# EAGLE design henryfc (EAGLE 9.6.2)
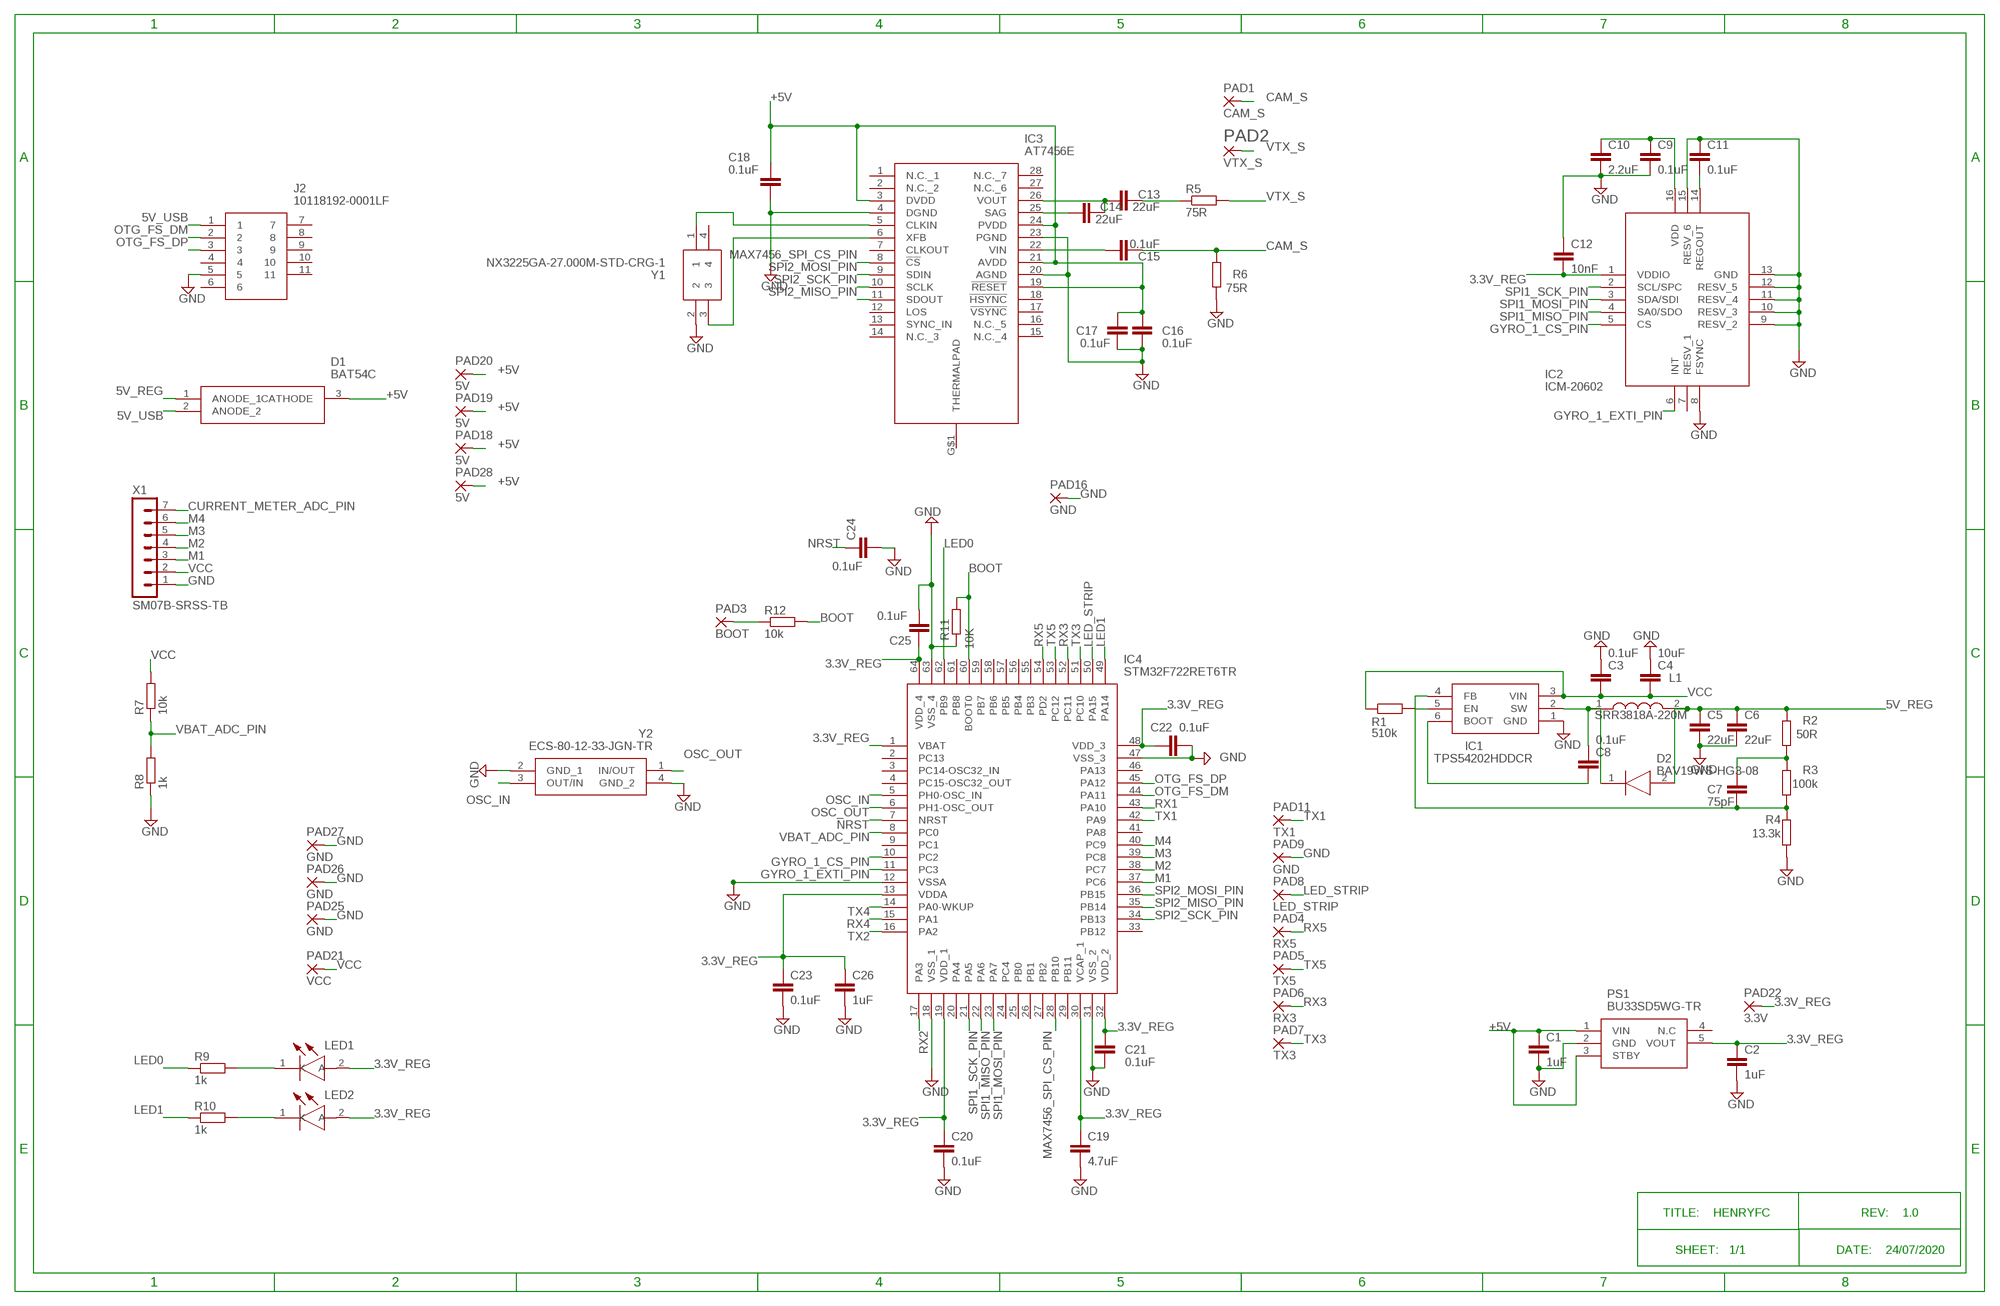
[diagram p0: schematic, sheet 1]

## Parts
C1  1uF  C-EUC0603  [C0603]
C2  1uF  C-EUC0603  [C0603]
C3  0.1uF  C-EUC0603  [C0603]
C4  10uF  C-EUC0603  [C0603]
C5  22uF  C-EUC0603  [C0603]
C6  22uF  C-EUC0603  [C0603]
C7  75pF  C-EUC0603  [C0603]
C8  0.1uF  C-EUC0603  [C0603]
C9  0.1uF  C-EUC0603  [C0603]
C10  2.2uF  C-EUC0603  [C0603]
C11  0.1uF  C-EUC0603  [C0603]
C12  10nF  C-EUC0603  [C0603]
C13  22uF  C-EUC0603  [C0603]
C14  22uF  C-EUC0603  [C0603]
C15  0.1uF  C-EUC0603  [C0603]
C16  0.1uF  C-EUC0603  [C0603]
C17  0.1uF  C-EUC0603  [C0603]
C18  0.1uF  C-EUC0603  [C0603]
C19  4.7uF  C-EUC0603  [C0603]
C20  0.1uF  C-EUC0603  [C0603]
C21  0.1uF  C-EUC0603  [C0603]
C22  0.1uF  C-EUC0603  [C0603]
C23  0.1uF  C-EUC0603  [C0603]
C24  0.1uF  C-EUC0603  [C0603]
C25  0.1uF  C-EUC0603  [C0603]
C26  1uF  C-EUC0603  [C0603]
D1  BAT54C  [SOT95P240X120-3N]
D2  BAV19WS-HG3-08  [SOD2713X115N]
IC1  TPS54202HDDCR  [SOT95P280X110-6N]
IC2  ICM-20602  [PULL-BACK-QFN-16]
IC3  AT7456E  [SOP65P640X120-29N]
IC4  STM32F722RET6TR  [QFP50P1200X1200X160-64N]
J2  10118192-0001LF  [101181920001LF]
L1  SRR3818A-220M  [SRR3818A3R3Y]
LED1  KB_DELPS2.12-QHRI-24-Z555-10-S  [KBDELPS212QHRI24Z55510S]
LED2  KR_DELPS1.22-UHVI-26-H3Q4  [KRDELPS122UHVI26H3Q4]
PAD1  CAM_S  SMD2  [SMD1,27-2,54]
PAD2  VTX_S  SMD2  [SMD1,27-2,54]
PAD3  BOOT  SMD2  [SMD1,27-2,54]
PAD4  RX5  SMD2  [SMD1,27-2,54]
PAD5  TX5  SMD2  [SMD1,27-2,54]
PAD6  RX3  SMD2  [SMD1,27-2,54]
PAD7  TX3  SMD2  [SMD1,27-2,54]
PAD8  LED_STRIP  SMD2  [SMD1,27-2,54]
PAD9  GND  SMD2  [SMD1,27-2,54]
PAD11  TX1  SMD2  [SMD1,27-2,54]
PAD16  GND  SMD2  [SMD1,27-2,54]
PAD18  5V  SMD2  [SMD1,27-2,54]
PAD19  5V  SMD2  [SMD1,27-2,54]
PAD20  5V  SMD2  [SMD1,27-2,54]
PAD21  VCC  SMD2  [SMD1,27-2,54]
PAD22  3.3V  SMD2  [SMD1,27-2,54]
PAD25  GND  SMD2  [SMD1,27-2,54]
PAD26  GND  SMD2  [SMD1,27-2,54]
PAD27  GND  SMD2  [SMD1,27-2,54]
PAD28  5V  SMD2  [SMD1,27-2,54]
PS1  BU33SD5WG-TR  [SOT95P280X125-5N]
R1  510k  R-EU_R0603  [R0603]
R2  50R  R-EU_R0603  [R0603]
R3  100k  R-EU_R0603  [R0603]
R4  13.3k  R-EU_R0603  [R0603]
R5  75R  R-EU_R0603  [R0603]
R6  75R  R-EU_R0603  [R0603]
R7  10k  R-EU_R0603  [R0603]
R8  1k  R-EU_R0603  [R0603]
R9  1k  R-EU_R0603  [R0603]
R10  1k  R-EU_R0603  [R0603]
R11  10K  R-EU_R0603  [R0603]
R12  10k  R-EU_R0603  [R0603]
X1  SM07B-SRSS-TB  [SM07B-SRSS-TB]
Y1  NX3225GA-27.000M-STD-CRG-1  [NX3225GA]
Y2  ECS-80-12-33-JGN-TR  [ECS801233JGNTR]

## Nets
3.3V_REG: C2.1 C12.2 C19.1 C20.1 C21.1 C22.1 C23.1 C25.1 C26.1 IC2.1(VDDIO) IC4.1(VBAT) IC4.13(VDDA) IC4.19(VDD_1) IC4.30(VCAP_1) IC4.32(VDD_2) IC4.48(VDD_3) IC4.64(VDD_4) LED1.2(A) LED2.2(A) PAD22.1(P) PS1.5(VOUT)
5V_REG: C5.1 C6.1 D1.1(ANODE_1) D2.2(A) L1.2 R2.2
5V_USB: D1.2(ANODE_2) J2.1
+5V: C1.1 C16.1 C17.1 C18.2 D1.3(CATHODE) IC3.3(DVDD) IC3.19(!RESET) IC3.21(AVDD) IC3.24(PVDD) PAD18.1(P) PAD19.1(P) PAD20.1(P) PAD28.1(P) PS1.1(VIN) PS1.3(STBY)
BOOT: IC4.60(BOOT0) R11.2 R12.2
CAM_S: C15.2 PAD1.1(P) R6.2
CURRENT_METER_ADC_PIN: X1.7
GND: C1.2 C2.2 C3.1 C4.1 C5.2 C6.2 C9.2 C10.2 C11.1 C12.1 C16.2 C17.2 C18.1 C19.2 C20.2 C21.2 C22.2 C23.2 C24.2 C25.2 C26.2 IC1.1(GND) IC2.8(FSYNC) IC2.9(RESV_2) IC2.10(RESV_3) IC2.11(RESV_4) IC2.12(RESV_5) IC2.13(GND) IC2.15(RESV_6) IC3.4(DGND) IC3.20(AGND) IC3.23(PGND) IC4.12(VSSA) IC4.18(VSS_1) IC4.31(VSS_2) IC4.47(VSS_3) IC4.63(VSS_4) J2.5 PAD9.1(P) PAD16.1(P) PAD25.1(P) PAD26.1(P) PAD27.1(P) PS1.2(GND) R4.1 R6.1 R8.1 R11.1 X1.1 Y1.2 Y2.2(GND_1) Y2.4(GND_2)
GYRO_1_CS_PIN: IC2.5(CS) IC4.10(PC2)
GYRO_1_EXTI_PIN: IC2.6(INT) IC4.11(PC3)
LED0: IC4.62(PB9) R9.1
LED1: IC4.49(PA14) R10.1
LED_STRIP: IC4.50(PA15) PAD8.1(P)
M1: IC4.37(PC6) X1.3
M2: IC4.38(PC7) X1.4
M3: IC4.39(PC8) X1.5
M4: IC4.40(PC9) X1.6
MAX7456_SPI_CS_PIN: IC3.8(!CS) IC4.28(PB10)
N$1: IC1.5(EN) R1.2
N$2: C8.1 D2.1(K) IC1.2(SW) L1.1
N$3: C7.1 R2.1 R3.2
N$4: C7.2 IC1.4(FB) R3.1 R4.2
N$5: C9.1 C10.1 IC2.16(VDD)
N$6: C8.2 IC1.6(BOOT)
N$7: C11.2 IC2.14(REGOUT)
N$8: C14.1 IC3.25(SAG)
N$9: C13.1 C14.2 IC3.26(VOUT)
N$10: C13.2 R5.1
N$11: IC3.6(XFB) Y1.3
N$12: C15.1 IC3.22(VIN)
N$13: IC3.5(CLKIN) Y1.1
N$14: LED1.1(K) R9.2
N$15: LED2.1(K) R10.2
N$16: PAD3.1(P) R12.1
NRST: C24.1 IC4.7(NRST)
OSC_IN: IC4.5(PH0-OSC_IN) Y2.3(OUT/IN)
OSC_OUT: IC4.6(PH1-OSC_OUT) Y2.1(IN/OUT)
OTG_FS_DM: IC4.44(PA11) J2.2
OTG_FS_DP: IC4.45(PA12) J2.3
RX1: IC4.43(PA10)
RX2: IC4.17(PA3)
RX3: IC4.52(PC11) PAD6.1(P)
RX4: IC4.15(PA1)
RX5: IC4.54(PD2) PAD4.1(P)
SPI1_MISO_PIN: IC2.4(SA0/SDO) IC4.22(PA6)
SPI1_MOSI_PIN: IC2.3(SDA/SDI) IC4.23(PA7)
SPI1_SCK_PIN: IC2.2(SCL/SPC) IC4.21(PA5)
SPI2_MISO_PIN: IC3.11(SDOUT) IC4.35(PB14)
SPI2_MOSI_PIN: IC3.9(SDIN) IC4.36(PB15)
SPI2_SCK_PIN: IC3.10(SCLK) IC4.34(PB13)
TX1: IC4.42(PA9) PAD11.1(P)
TX2: IC4.16(PA2)
TX3: IC4.51(PC10) PAD7.1(P)
TX4: IC4.14(PA0-WKUP)
TX5: IC4.53(PC12) PAD5.1(P)
VBAT_ADC_PIN: IC4.8(PC0) R7.1 R8.2
VCC: C3.2 C4.2 IC1.3(VIN) PAD21.1(P) R1.1 R7.2 X1.2
VTX_S: PAD2.1(P) R5.2
Unconnected: IC2.7(RESV_1) IC3.1(N.C._1) IC3.2(N.C._2) IC3.7(CLKOUT) IC3.12(LOS) IC3.13(SYNC_IN) IC3.14(N.C._3) IC3.15(N.C._4) IC3.16(N.C._5) IC3.17(!VSYNC) IC3.18(!HSYNC) IC3.27(N.C._6) IC3.28(N.C._7) IC3.G$1(THERMALPAD) IC4.2(PC13) IC4.3(PC14-OSC32_IN) IC4.4(PC15-OSC32_OUT) IC4.9(PC1) IC4.20(PA4) IC4.24(PC4) IC4.25(PB0) IC4.26(PB1) IC4.27(PB2) IC4.29(PB11) IC4.33(PB12) IC4.41(PA8) IC4.46(PA13) IC4.55(PB3) IC4.56(PB4) IC4.57(PB5) IC4.58(PB6) IC4.59(PB7) IC4.61(PB8) J2.4 J2.6 J2.7 J2.8 J2.9 J2.10 J2.11 PS1.4(N.C) Y1.4

## Notes on the sheet
- TITLE:    HENRYFC | REV:    1.0
- SHEET:   1/1 | DATE:    24/07/2020

## Library data of the parts
C1-C26 = rcl:C-EU: CAPACITOR, European symbol; SPICEPREFIX: C
D1 = SamacSys_Parts:BAT54C: 30 V Dual Common Cathode Schottky Diode Source: Datasheet <http://www.onsemi.com/pub/Collateral/BAT54-D.PDF>; ARROW_PART_NUMBER: BAT54C; ARROW_PRICE-STOCK: https://www.arrow.com/en/products/bat54c/on-semiconductor; DESCRIPTION: 30 V Dual Common Cathode Schottky Diode; HEIGHT: 1.2mm; MANUFACTURER_NAME: ON Semiconductor; MANUFACTURER_PART_NUMBER: BAT54C; MOUSER_PART_NUMBER: 512-BAT54C; MOUSER_PRICE-STOCK: https://www.mouser.co.uk/ProductDetail/ON-Semiconductor-Fairchild/BAT54C?qs=WjC1ij5gCHPafNqzK0iwGA%3D%3D
D2 = SamacSys_Parts:BAV19WS-HG3-08: Diodes - General Purpose, Power, Switching Source: Datasheet <https://componentsearchengine.com/Datasheets/1/BAV19WS-HG3-08.pdf>; ARROW_PART_NUMBER: BAV19WS-HG3-08; DESCRIPTION: Diodes - General Purpose, Power, Switching; HEIGHT: 1.15mm; MANUFACTURER_NAME: Vishay; MANUFACTURER_PART_NUMBER: BAV19WS-HG3-08; MOUSER_PART_NUMBER: 78-BAV19WS-HG3-08; MOUSER_PRICE-STOCK: https://www.mouser.co.uk/ProductDetail/Vishay-Semiconductors/BAV19WS-HG3-08?qs=BJlw7L4Cy7%252Bw9Fy5s7UwAA%3D%3D
IC1 = SamacSys_Parts:TPS54202HDDCR: 4.5V to 28V Input, 2A Output, Synchronous Step-Down Voltage Converter Source: Datasheet <http://www.ti.com/lit/gpn/tps54202h>; ARROW_PART_NUMBER: TPS54202HDDCR; ARROW_PRICE-STOCK: https://www.arrow.com/en/products/tps54202hddcr/texas-instruments; DESCRIPTION: 4.5V to 28V Input, 2A Output, Synchronous Step-Down Voltage Converter; HEIGHT: 1.1mm; MANUFACTURER_NAME: Texas Instruments; MANUFACTURER_PART_NUMBER: TPS54202HDDCR; MOUSER_PART_NUMBER: 595-TPS54202HDDCR; MOUSER_PRICE-STOCK: https://www.mouser.co.uk/ProductDetail/Texas-Instruments/TPS54202HDDCR?qs=uP22XH7NdCtzy%252BOdxI8qhQ%3D%3D
IC2 = SamacSys_Parts:ICM-20602: High Performance 6-Axis MEMS MotionTracking Device, QFN-16 Source: Datasheet <https://www.invensense.com/wp-content/uploads/2015/12/ICM-20602-Product-Brief-v1.0.pdf>; ARROW_PART_NUMBER: ICM-20602; ARROW_PRICE-STOCK: https://www.arrow.com/en/products/icm-20602/invensense; DESCRIPTION: High Performance 6-Axis MEMS MotionTracking Device, QFN-16; HEIGHT: mm; MANUFACTURER_NAME: InvenSense Inc.; MANUFACTURER_PART_NUMBER: ICM-20602; MOUSER_PART_NUMBER: 410-ICM-20602; MOUSER_PRICE-STOCK: https://www.mouser.co.uk/ProductDetail/TDK-InvenSense/ICM-20602?qs=u4fy%2FsgLU9NtDChFbqTxBA%3D%3D
IC3 = SamacSys_Parts:AT7456E: Video Character Overlay Chip (OSD) Source: Datasheet <https://datasheet.lcsc.com/szlcsc/ZHONGKEWEI-AT7456E_C82351.pdf>; ARROW_PART_NUMBER: AT7456E; DESCRIPTION: Video Character Overlay Chip (OSD); HEIGHT: 1.2mm; MANUFACTURER_NAME: ICOF; MANUFACTURER_PART_NUMBER: AT7456E
IC4 = SamacSys_Parts:STM32F722RET6TR: ARM Microcontrollers - MCU Source: Datasheet <https://componentsearchengine.com/Datasheets/1/STM32F722RET6TR.pdf>; ARROW_PART_NUMBER: STM32F722RET6TR; DESCRIPTION: ARM Microcontrollers - MCU; HEIGHT: 1.6mm; MANUFACTURER_NAME: STMicroelectronics; MANUFACTURER_PART_NUMBER: STM32F722RET6TR; MOUSER_PART_NUMBER: 511-STM32F722RET6TR; MOUSER_PRICE-STOCK: https://www.mouser.co.uk/ProductDetail/STMicroelectronics/STM32F722RET6TR?qs=%252B6g0mu59x7LDsd7i9LBalQ%3D%3D
J2 = SamacSys_Parts:10118192-0001LF: USB Connectors 5P MICRO USB TYPE B RECEPTACLE Source: Datasheet <https://www.mouser.tw/datasheet/2/18/10118192-1361887.pdf>; ARROW_PART_NUMBER: 10118192-0001LF; ARROW_PRICE-STOCK: https://www.arrow.com/en/products/10118192-0001lf/amphenol-fci; DESCRIPTION: USB Connectors 5P MICRO USB TYPE B RECEPTACLE; HEIGHT: 2.8mm; MANUFACTURER_NAME: Amphenol; MANUFACTURER_PART_NUMBER: 10118192-0001LF; MOUSER_PART_NUMBER: 649-10118192-0001LF; MOUSER_PRICE-STOCK: https://www.mouser.co.uk/ProductDetail/Amphenol-FCI/10118192-0001LF?qs=Ywefl8B65e5bHFoQtIudZg%3D%3D
L1 = SamacSys_Parts:SRR3818A-220M: Fixed Inductors Ind,3.8x3.8x1.8mm,15uH20%,1.05A,shdSMD Source: Datasheet <https://componentsearchengine.com/Datasheets/1/SRR3818A-3R3Y.pdf>; ARROW_PART_NUMBER: SRR3818A-220M; DESCRIPTION: Fixed Inductors Ind,3.8x3.8x1.8mm,15uH20%,1.05A,shdSMD; HEIGHT: 2mm; MANUFACTURER_NAME: Bourns; MANUFACTURER_PART_NUMBER: SRR3818A-220M; MOUSER_PART_NUMBER: 652-SRR3818A-220M; MOUSER_PRICE-STOCK: https://www.mouser.co.uk/ProductDetail/Bourns/SRR3818A-220M?qs=gZXFycFWdAPThB897lLFmQ%3D%3D
LED1 = SamacSys_Parts:KB_DELPS2.12-QHRI-24-Z555-10-S: Standard LEDs - SMD Blue TOPLED E 1608 Source: Datasheet <https://www.mouser.in/ProductDetail/OSRAM-Opto-Semiconductors/KB-DELPS212-QHRI-24-Z555-10-S?qs=/ha2pyFaduguGXnxUQPQvOwqvA0l1GbBGsJPdL2BNxwU00XGTd8yf8CXZb0fb41Mz9FjufZkGgQ=>; ARROW_PART_NUMBER: KB DELPS2.12-QHRI-24-Z555-10-S; DESCRIPTION: Standard LEDs - SMD Blue TOPLED E 1608; HEIGHT: mm; MANUFACTURER_NAME: OSRAM; MANUFACTURER_PART_NUMBER: KB DELPS2.12-QHRI-24-Z555-10-S; MOUSER_PART_NUMBER: 720-KBDELPS212A6350; MOUSER_PRICE-STOCK: https://www.mouser.co.uk/ProductDetail/OSRAM-Opto-Semiconductors/KB-DELPS212-QHRI-24-Z555-10-S?qs=OTrKUuiFdkb2rezknsx9mQ%3D%3D
LED2 = SamacSys_Parts:KR_DELPS1.22-UHVI-26-H3Q4: Standard LEDs - SMD Red TOPLED E 1608 Source: Datasheet <https://www.mouser.co.uk/ProductDetail/OSRAM-Opto-Semiconductors/KR-DELPS122-UHVI-26-H3Q4?qs=sGAEpiMZZMseGfSY3csMkXiJOH5X%2BfXw4kv80xILcLqjWCSyCkalLg==>; ARROW_PART_NUMBER: KR DELPS1.22-UHVI-26-H3Q4; DESCRIPTION: Standard LEDs - SMD Red TOPLED E 1608; HEIGHT: mm; MANUFACTURER_NAME: OSRAM; MANUFACTURER_PART_NUMBER: KR DELPS1.22-UHVI-26-H3Q4; MOUSER_PART_NUMBER: 720-KRDELPS122A5163; MOUSER_PRICE-STOCK: https://www.mouser.co.uk/ProductDetail/OSRAM-Opto-Semiconductors/KR-DELPS122-UHVI-26-H3Q4?qs=XeJtXLiO41Rxc1kIEv94zQ%3D%3D
PAD1-PAD9 PAD11 PAD16 PAD18-PAD22 PAD25-PAD28 = wirepad:SMD2: SMD PAD
PS1 = SamacSys_Parts:BU33SD5WG-TR: LDO regulator,3.3V,0.5A,standby,SSOP5 ROHM BU33SD5WG-TR, LDO Voltage Regulator, 0.5A, 3.3 V +/-2%, 1.7 6 Vin, 5-Pin SSOP Source: Datasheet <https://componentsearchengine.com/Datasheets/1/BU33SD5WG-TR.pdf>; ARROW_PART_NUMBER: BU33SD5WG-TR; DESCRIPTION: LDO regulator,3.3V,0.5A,standby,SSOP5 ROHM BU33SD5WG-TR, LDO Voltage Regulator, 0.5A, 3.3 V +/-2%, 1.7 6 Vin, 5-Pin SSOP; HEIGHT: 1.25mm; MANUFACTURER_NAME: ROHM Semiconductor; MANUFACTURER_PART_NUMBER: BU33SD5WG-TR; MOUSER_PART_NUMBER: 755-BU33SD5WG-TR; MOUSER_PRICE-STOCK: https://www.mouser.co.uk/ProductDetail/ROHM-Semiconductor/BU33SD5WG-TR?qs=%2FKR40Cd6GUrQDzRkUEt69Q%3D%3D
R1-R12 = rcl:R-EU_: RESISTOR, European symbol; SPICEPREFIX: R
X1 = con-JST:SM07B-SRSS: JST SH series header 1.00mm pitch disconnectable crimp style connectors, horizontal (side entry type), 7 pins
Y1 = SamacSys_Parts:NX3225GA-27.000M-STD-CRG-1: Crystals CRYSTAL 27MHz 8PF SMD Source: Datasheet <https://www.ndk.com/images/products/catalog/c_NX3225GA-STD-CRG-2_e.pdf>; ARROW_PART_NUMBER: NX3225GA-27.000M-STD-CRG-1; DESCRIPTION: Crystals CRYSTAL 27MHz 8PF SMD; HEIGHT: mm; MANUFACTURER_NAME: NDK; MANUFACTURER_PART_NUMBER: NX3225GA-27.000M-STD-CRG-1; MOUSER_PART_NUMBER: 344-NX3225GA27MSTRG1; MOUSER_PRICE-STOCK: https://www.mouser.com/Search/Refine.aspx?Keyword=344-NX3225GA27MSTRG1
Y2 = SamacSys_Parts:ECS-80-12-33-JGN-TR: Crystals 8MHz 1.6-3.6V 30PPM -40C +85C Source: Datasheet <https://ecsxtal.com/store/pdf/ecx-32.pdf>; ARROW_PART_NUMBER: ECS-80-12-33-JGN-TR; ARROW_PRICE-STOCK: https://www.arrow.com/en/products/ecs-80-12-33-jgn-tr/ecs-international; DESCRIPTION: Crystals 8MHz 1.6-3.6V 30PPM -40C +85C; HEIGHT: 0.8mm; MANUFACTURER_NAME: ECS; MANUFACTURER_PART_NUMBER: ECS-80-12-33-JGN-TR; MOUSER_PART_NUMBER: 520-80-12-33-JGN-TR; MOUSER_PRICE-STOCK: https://www.mouser.co.uk/ProductDetail/ECS/ECS-80-12-33-JGN-TR?qs=d0WKAl%252BL4KaVcQK0q%252BTt4Q%3D%3D

## Board
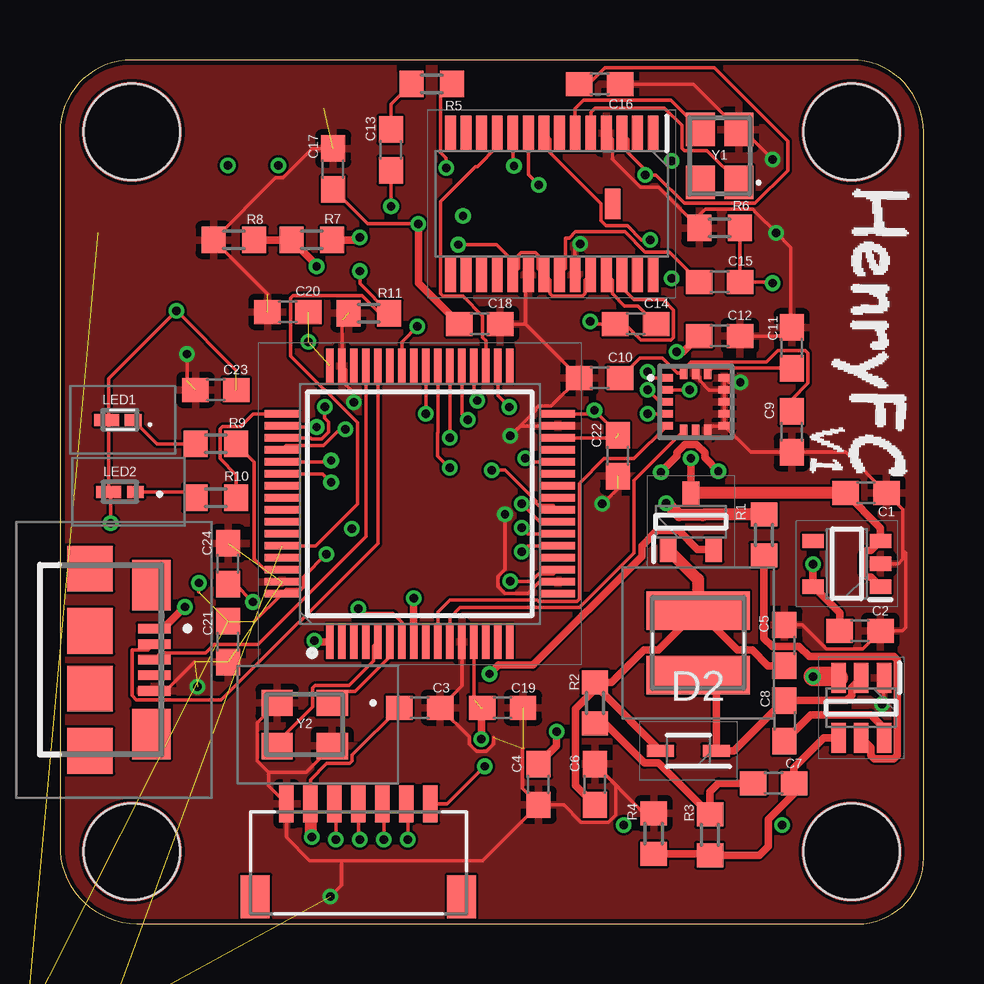
[diagram p1: board, top side]
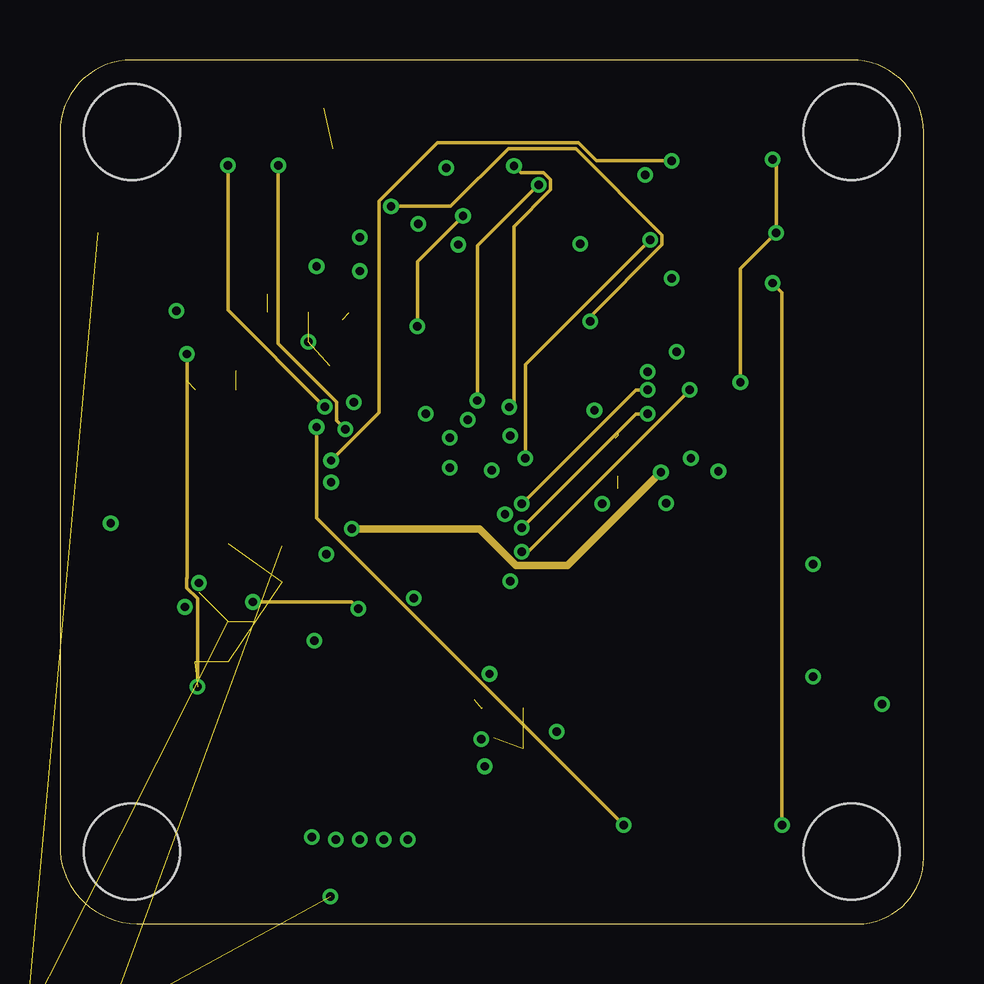
[diagram p2: board, inner layer Route2]
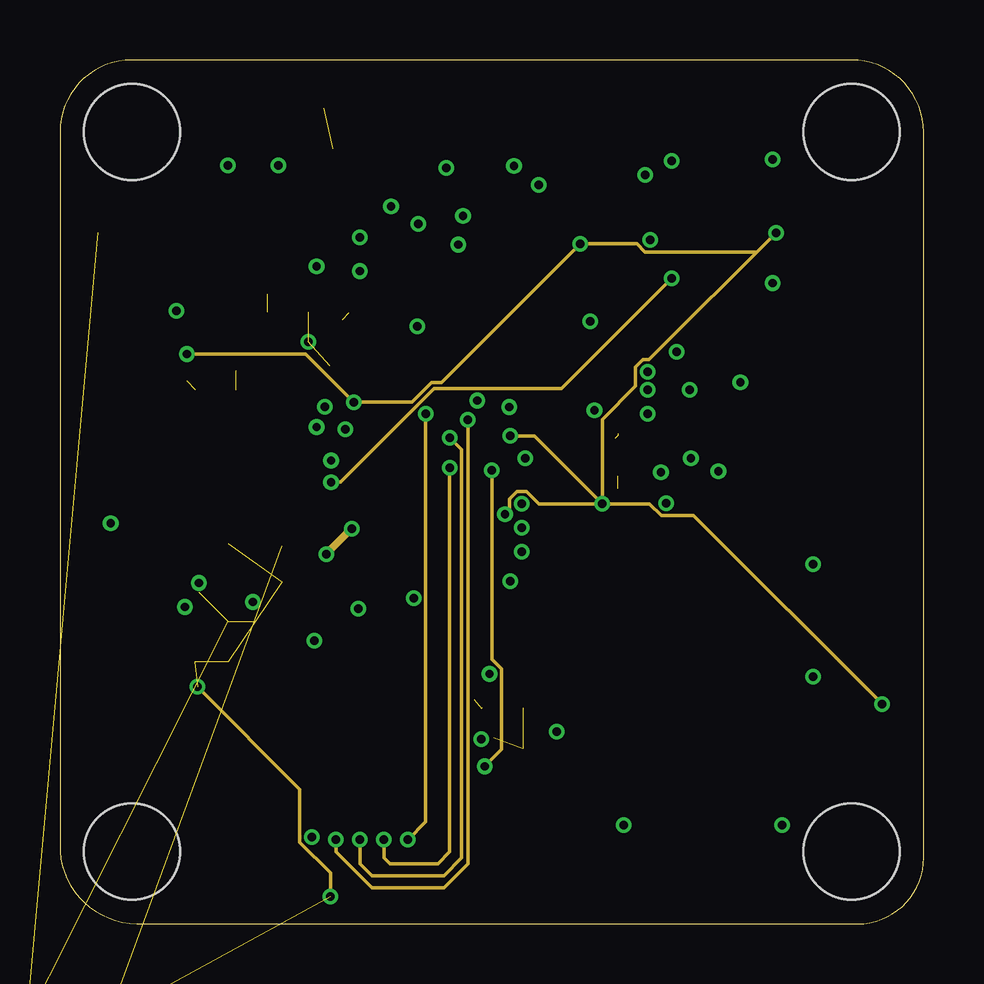
[diagram p3: board, inner layer Route15]
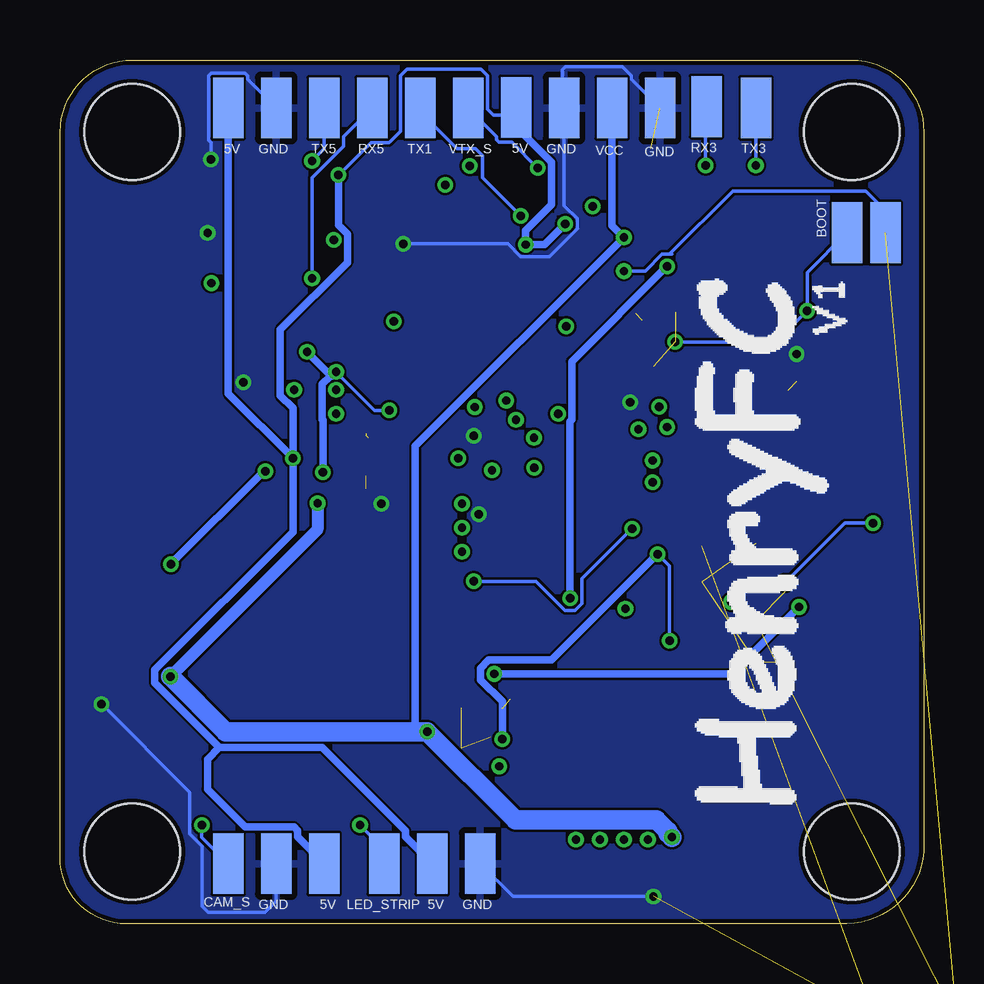
[diagram p4: board, bottom side, seen from below]

Size 36.01 x 36.01 mm. Coordinates in mm from the lower left corner, seen from the top.
Outline: 33,36.01 3,36.01 arc90 0,33.01 0,3.01 arc90 3.5,0.01 33.5,0.01 arc90 36,3.01 36,33.01 arc90 33,36.01
Copper layers (1+2*15+16): Top 0.035mm / dielectric 0.2mm / Route2 0.018mm / dielectric 1.5mm / Route15 0.018mm / dielectric 0.2mm / Bottom 0.035mm
Design rules "aisler_4_layer": minimum track width 0.1mm, minimum drill 0.2mm, track to track 0.1mm, track to pad 0.1mm, pad to pad 0.1mm, via to via 0.1mm, smd to smd 0.1mm, copper to edge 0.2mm, drill to drill 0.21mm, minimum pad ring 0.25mm, minimum via ring 0.15mm, stop-mask expansion 0mil, vias tented up to drill 0mil, thermal gap 10mil
Holes 4 mm at 3,33.01 33,33.01 33,3.01 3,3.01

### Footprints (pad centres in the part's own frame; a part is rotated, then mirrored left to right if it is on the bottom)
C0603 = smd 1.1 x 1: 1 -0.85,0; 2 0.85,0
SOT95P240X120-3N = smd 1.05 x 0.7: 1 -1.15,0.95; 2 -1.15,-0.95; 3 1.15,0
SOD2713X115N = smd 1.125 x 0.5: 1 -1.162,0; 2 1.162,0
SOT95P280X110-6N = smd 1.25 x 0.6: 1 -1.25,0.95; 2 -1.25,0; 3 -1.25,-0.95; 4 1.25,-0.95; 5 1.25,0; 6 1.25,0.95
PULL-BACK-QFN-16 = smd 0.5 x 0.3: 1 -1.2,1; 2 -1.2,0.5; 3 -1.2,0; 4 -1.2,-0.5; 5 -1.2,-1; 9 1.2,-1; 10 1.2,-0.5; 11 1.2,0; 12 1.2,0.5; 13 1.2,1 | smd 0.3 x 0.5: 6 -0.5,-1.2; 7 0,-1.2; 8 0.5,-1.2; 14 0.5,1.2; 15 0,1.2; 16 -0.5,1.2
SOP65P640X120-29N = smd 1.475 x 0.45: 1 -2.938,4.225; 2 -2.938,3.575; 3 -2.938,2.925; 4 -2.938,2.275; 5 -2.938,1.625; 6 -2.938,0.975; 7 -2.938,0.325; 8 -2.938,-0.325; 9 -2.938,-0.975; 10 -2.938,-1.625; 11 -2.938,-2.275; 12 -2.938,-2.925; 13 -2.938,-3.575; 14 -2.938,-4.225; 15 2.938,-4.225; 16 2.938,-3.575; 17 2.938,-2.925; 18 2.938,-2.275; 19 2.938,-1.625; 20 2.938,-0.975; 21 2.938,-0.325; 22 2.938,0.325; 23 2.938,0.975; 24 2.938,1.625; 25 2.938,2.275; 26 2.938,2.925; 27 2.938,3.575; 28 2.938,4.225 | smd 1.27 x 0.635: G$1 0,2.54
QFP50P1200X1200X160-64N = smd 1.45 x 0.3: 1 -5.75,3.75; 2 -5.75,3.25; 3 -5.75,2.75; 4 -5.75,2.25; 5 -5.75,1.75; 6 -5.75,1.25; 7 -5.75,0.75; 8 -5.75,0.25; 9 -5.75,-0.25; 10 -5.75,-0.75; 11 -5.75,-1.25; 12 -5.75,-1.75; 13 -5.75,-2.25; 14 -5.75,-2.75; 15 -5.75,-3.25; 16 -5.75,-3.75; 33 5.75,-3.75; 34 5.75,-3.25; 35 5.75,-2.75; 36 5.75,-2.25; 37 5.75,-1.75; 38 5.75,-1.25; 39 5.75,-0.75; 40 5.75,-0.25; 41 5.75,0.25; 42 5.75,0.75; 43 5.75,1.25; 44 5.75,1.75; 45 5.75,2.25; 46 5.75,2.75; 47 5.75,3.25; 48 5.75,3.75 | smd 0.3 x 1.45: 17 -3.75,-5.75; 18 -3.25,-5.75; 19 -2.75,-5.75; 20 -2.25,-5.75; 21 -1.75,-5.75; 22 -1.25,-5.75; 23 -0.75,-5.75; 24 -0.25,-5.75; 25 0.25,-5.75; 26 0.75,-5.75; 27 1.25,-5.75; 28 1.75,-5.75; 29 2.25,-5.75; 30 2.75,-5.75; 31 3.25,-5.75; 32 3.75,-5.75; 49 3.75,5.75; 50 3.25,5.75; 51 2.75,5.75; 52 2.25,5.75; 53 1.75,5.75; 54 1.25,5.75; 55 0.75,5.75; 56 0.25,5.75; 57 -0.25,5.75; 58 -0.75,5.75; 59 -1.25,5.75; 60 -1.75,5.75; 61 -2.25,5.75; 62 -2.75,5.75; 63 -3.25,5.75; 64 -3.75,5.75
101181920001LF = smd 0.4 x 1.35: 1 -1.3,1.682; 2 -0.65,1.682; 3 0,1.682; 4 0.65,1.682; 5 1.3,1.682 | smd 2.1 x 1.6: 6 -3.1,1.557; 7 3.1,1.557 | smd 1.9 x 1.9: 8 -1.2,-0.993; 9 1.2,-0.993; 10 -3.8,-0.993; 11 3.8,-0.993
SRR3818A3R3Y = smd 4.3 x 1.6: 1 0,1.35; 2 0,-1.35
KBDELPS212QHRI24Z55510S = smd 0.7 x 0.5: 1 -0.558,0 | smd 1.05 x 0.5: 2 0.558,0
KRDELPS122UHVI26H3Q4 = smd 0.7 x 0.5: 1 -0.645,0 | smd 1.05 x 0.5: 2 0.47,0
SMD1,27-2,54 = smd 1.27 x 2.54: 1 0,0
SOT95P280X125-5N = smd 0.9 x 0.6: 1 -1.4,0.95; 2 -1.4,0; 3 -1.4,-0.95; 4 1.4,-0.95; 5 1.4,0.95
R0603 = smd 1 x 1.1: 1 -0.85,0; 2 0.85,0
SM07B-SRSS-TB = smd 0.6 x 1.55: 1 3,0; 2 2,0; 3 1,0; 4 0,0; 5 -1,0; 6 -2,0; 7 -3,0 | smd 1.2 x 1.8: M1 4.3,3.875; M2 -4.3,3.875
NX3225GA = smd 1.4 x 1.2: 1 -1.1,-0.8; 2 1.1,-0.8; 3 1.1,0.8; 4 -1.1,0.8
ECS801233JGNTR = smd 1.3 x 1.1: 1 -1.15,-0.9; 2 1.15,-0.9; 3 1.15,0.9; 4 -1.15,0.9

### Placement (x,y rotation side)
C1  33.6,17.96 0 top
C2  33.35,12.21 0 top
C3  15,9.01 180 top
C4  19.95,5.81 90 top
C5  30.2,11.61 90 top
C6  22.3,5.81 90 top
C7  29.75,5.86 0 top
C8  30.2,8.46 270 top
C9  30.5,20.51 270 top
C10  22.5,22.76 180 top
C11  30.5,24.01 270 top
C12  27.5,24.51 180 top
C13  13.8,32.26 90 top
C14  24,25.01 180 top
C15  27.5,26.76 0 top
C16  22.5,35.01 0 top
C17  11.39,31.46 90 top
C18  17.5,25.01 180 top
C19  18.45,9.01 0 top
C20  9.5,25.51 180 top
C21  7,11.76 270 top
C22  23.25,19.51 270 top
C23  6.5,22.26 180 top
C24  7,15.01 90 top
C25  -1.08,-5.14 0 top  (outside the outline)
C26  -1.08,-14.96 0 top  (outside the outline)
D1  26.3,16.76 90 top
D2  26.2,7.21 180 top
IC1  33.4,9.01 270 top
IC2  26.5,21.76 0 top
IC3  20.5,30.01 270 top
IC4  15,17.51 90 top
J2  2.25,11.01 270 top
L1  26.6,11.71 180 top
LED1  2.5,21.01 180 top
LED2  2.5,18.01 180 top
PAD1  29,2.51 0 bottom
PAD2  19,34.01 180 bottom
PAD3  1.6,28.81 180 bottom
PAD4  23,34.01 180 bottom
PAD5  25,34.01 180 bottom
PAD6  9.06,34.07 180 bottom
PAD7  7,34.01 180 bottom
PAD8  22.5,2.51 180 bottom
PAD9  27,34.01 180 bottom
PAD11  21,34.01 180 bottom
PAD16  27,2.51 0 bottom
PAD18  29,34.01 0 bottom
PAD19  16.99,34.03 180 bottom
PAD20  25,2.51 180 bottom
PAD21  13,34.01 0 bottom
PAD22  3.2,28.81 180 bottom
PAD25  11,34.01 0 bottom
PAD26  15,34.01 0 bottom
PAD27  18.5,2.51 180 bottom
PAD28  20.5,2.51 0 bottom
PS1  32.8,15.01 180 top
R1  29.35,16.21 270 top
R2  22.3,9.21 90 top
R3  27.1,3.71 90 top
R4  24.75,3.76 270 top
R5  15.5,35.01 0 top
R6  27.5,29.01 0 top
R7  10.5,28.51 0 top
R8  7.25,28.51 0 top
R9  6.5,20.01 180 top
R10  6.5,17.76 180 top
R11  12.88,25.45 0 top
R12  -1.08,-10.05 0 top  (outside the outline)
X1  12.44,5 180 top
Y1  27.5,32.01 90 top
Y2  10.2,8.31 180 top

### Tracks (layer width: path | path; a pad name or v marks a point on that pad's centre or on a via)
3.3V_REG  (via drill 0.35)  (11 unrouted)
  Top 0.152: IC2.1 24.75,22.76 v24.5,23.01 | LED2.2 2.03,22.72 v4.86,25.55 7.35,23.06 | IC4.13 17.25,9.36 | v11.1,15.41 10.15,14.46 10.15,14.04 10.05,13.93 9.42,13.93 IC4.64 8.1,12.61 | v2.12,16.7 2.12,17.92 LED2.2 | 5.79,13.82 v5.79,14.21 | 23.15,20.26 IC4.30 | 23.25,20.43 v22.28,21.4 22.14,21.26 IC4.32 | IC4.19 20.58,14.59 19.95,14.59 19.65,14.28 v18.77,14.28 | v10.35,24.27 v10.36,24.26 | LED1.2 2.03,20.92 LED2.2
  Top 0.305: C2.1 32.5,12.96 PS1.5 v31.39,14.99 | IC4.1 10.65,11.76 v10.6,11.81 | v27.45,18.86 26.88,19.43 26.88,19.65 26.54,19.99 26.06,19.99 25.72,19.65 25.72,19.5 v25.05,18.82 | v25.71,23.84 25.98,23.84 C12.2 | v17.57,7.69 17.57,8.98
  Route2 0.305: v25.05,18.82 21.16,14.93 19.01,14.93 17.48,16.46 v12.16,16.46 v12.16,16.47
  Route15 0.305: v12.16,16.47 v11.1,15.41
  Bottom 0.152: v10.6,11.81 10.6,14.91 v11.1,15.41 | PAD22.1 4.86,27.15 v4.86,25.55 6.15,24.26 v10.36,24.26 | v24.5,23.01 22.89,21.4 v22.28,21.4 | v18.77,14.28 16.16,14.28 14.95,13.07 14.54,13.07 14.25,13.36 14.25,14.39 v12.16,16.47 | v2.12,16.7 3.29,16.7 v5.79,14.21
  Bottom 0.305: v31.39,14.99 27.52,18.86 v27.45,18.86 | v25.05,18.82 25.05,20.99 25.08,21.02 25.08,22.5 24.74,22.84 24.67,22.84 v24.5,23.01 24.88,23.01 v25.71,23.84 | v11.1,15.41 15.52,10.99 18.14,10.99 18.48,10.65 18.48,10.17 17.57,9.26 v17.57,7.69
5V_REG
  Top 0.305: 22.3,9.77 R2.2 22.99,10.06 24.34,11.41 24.95,11.41 L1.2 28.25,11.41 28.86,11.41 29.51,10.76 C5.1 | 22.3,9.77 21.5,8.96 21.5,5.76 C6.1 | D2.2 22.48,9.77 22.3,9.77
  Top 0.508: D1.1 26.6,14.36 L1.2
5V_USB  (via drill 0.35)
  Top 0.305: v17.9,10.41 18.27,10.78 19.72,10.78 24.25,15.32 24.25,15.75 24.89,16.39 25.8,16.39 26.58,15.61 D1.2 | v5.2,13.21 4.3,12.31 J2.1
  Bottom 0.305: v17.9,10.41 8,10.41 v5.2,13.21
+5V  (via drill 0.35)
  Top 0.152: IC3.24 21.88,26.82 21.88,26.26 21.77,26.16 20.53,26.16 20.42,26.26 20.42,26.82 IC3.21 19.93,27.32 19.93,27.88 19.82,27.99 19.23,27.99 19.12,27.88 19.12,27.32 IC3.19 18.88,27.63 18.2,28.31 v16.6,28.31 | C16.1 21.53,34.89 21.93,34.89 22.73,35.69 27.27,35.69 30.34,32.62 30.34,31.4 28.97,30.03 26.03,30.03 24.85,31.21 v24.4,31.21 24.4,31.41 23.67,32.14 23.67,32.7 IC3.3 | C17.1 12.82,29.18 v14.94,29.18
  Top 0.305: PS1.1 33.8,14.46 33.65,14.46 33.5,14.6 33.5,15.41 33.65,15.56 33.8,15.56 PS1.3 34.2,16.51 C1.1 | v26.3,19.41 D1.3 | C18.2 14.94,26.72 v14.94,29.18
  Top 0.508: C1.1 26.35,17.96 D1.3
  Bottom 0.152: v24.4,31.21 23.05,32.56 22.29,32.56 21.81,33.04 21.81,35.35 21.54,35.62 18.46,35.62 18.19,35.35 18.19,33.96 17.94,33.71 16.99,33.71
  Bottom 0.305: PAD19.1 16.99,33.71 16.99,33.22 15.52,31.75 15.52,29.97 16.6,28.89 v16.6,28.31 15.81,28.31 v14.94,29.18 | PAD18.1 29,22.11 v26.3,19.41 | PAD28.1 21.61,3.62 21.61,3.88 25.08,7.35 29.37,7.35 | 29.37,7.35 32.06,10.04 32.06,10.58 26.3,16.34 v26.3,19.41 | 29.37,7.35 29.86,6.86 29.86,5.61 28.29,4.03 26.26,4.03 26.11,3.88 26.11,3.62 PAD20.1 | v26.3,19.41 26.3,21.49 26.83,22.02 26.83,24.77 24.02,27.57 24.02,28.75 24.4,29.13 v24.4,31.21
BOOT  (via drill 0.35)  (1 unrouted)
  Top 0.152: IC4.60 10.65,15.76 12.4,17.51 12.4,20.89 9.62,23.66 9.62,26.08 9.73,26.19 12.59,26.19 13.33,25.45 R11.2 12.5,26.68 v12.5,27.21
  Bottom 0.152: 10.49,27.91 10.6,27.91 | 10.6,27.91 10.91,27.91 11.61,27.21 v12.5,27.21 | 10.6,27.91 7.96,30.55 2.42,30.55 1.6,29.73
CAM_S  (via drill 0.35)
  Top 0.152: R6.2 C15.2 29.65,26.76 v29.7,26.71
  Route2 0.152: v30.1,4.11 30.1,26.31 v29.7,26.71
  Bottom 0.152: PAD1.1 30.1,3.61 v30.1,4.11
CURRENT_METER_ADC_PIN  (via drill 0.35)
  Top 0.152: 20.58,17.43 19.95,17.43 19.85,17.54 19.85,17.62 18.56,18.91 v18,18.91 | v17.71,6.56 16.14,5 X1.7
  Route15 0.152: v18,18.91 18,11.03 18.41,10.62 18.41,7.26 v17.71,6.56
GND  (via drill 0.35)  (13 unrouted)
  Top 0.152: 21.15,20.76 IC4.31 19.19,20.76 v18.77,20.34 19.85,21.42 19.85,21.48 19.95,21.59 20.48,21.59 C10.2 19.4,25.01 | 11.75,25.17 IC4.47 11.92,23.09 11.92,22.46 12.25,22.14 v12.25,21.75 | 5.61,10.91 4.41,9.71 J2.5 | C4.1 17.62,2.63 11.75,2.63 | 11.75,2.63 10.41,2.63 9.44,3.6 X1.1 8.7,5.74 8.7,6.32 | C2.2 34.55,11.86 | IC2.12 IC2.11 IC2.10 IC2.9 | IC2.12 IC2.13 27.89,22.57 v28.36,22.57 | IC2.9 28.8,19.66 C9.2 32.75,19.66 C1.2 35.14,17.27 35.14,15.57 | IC2.8 27.2,20.76 IC2.9 | IC2.15 26.67,22.79 26.67,22.64 27.05,22.26 IC2.12 | C16.2 26.4,35.01 Y1.2 28.46,33.11 v29.71,31.86 | IC1.1 34.35,9.23 v34.28,9.16 | IC3.23 21.48,28.12 v21.7,28.34 | C18.1 19.4,25.01 | C17.2 10.51,32.31 9.31,31.11 9,31.11 R8.1 8.65,26.26 | IC3.20 19.4,26.95 19.4,25.01 | 29.03,29.63 v29.85,28.8 30.47,28.19 30.47,24.83 | 29.03,29.63 | 29.03,29.63 28.88,29.78 26.9,29.78 26.65,29.53 R6.1 24.95,30.71 24.19,30.71 23.02,31.88 23.02,32.7 IC3.4 | C11.1 30.47,24.83 | 30.47,24.83 30.15,24.51 C12.1 | 23.25,18.15 v22.61,17.51 | PS1.2 34.95,15.01 35.14,15.21 35.14,15.57 | C5.2 30.95,12.46 31.95,11.47 33.48,11.47 34.2,12.19 C2.2 | C2.2 35.12,12.21 35.26,12.35 35.26,15.46 35.14,15.57 | Y2.4 10.26,6.32 8.7,6.32 | 8.7,6.32 8.22,6.79 8.22,8.38 Y2.2 | IC4.18 19.98,14.26 19.5,13.78 18.56,13.78 18.26,14.07 18.26,14.49 18.55,14.78 v18.55,17.07 | 18.07,7.78 18.07,7.48 17.78,7.19 17.36,7.19 17.07,7.48 17.07,7.79 C3.1 16.75,9.91 IC4.12 | C4.1 21,4.96 21.73,4.23 22.87,4.23 23.19,4.55 23.19,5.77 C6.2 24.35,4.61 R4.1 | 5.29,22.61 v5.29,23.75 | 19.3,7.31 19.27,7.28 19.27,5.64 C4.1 | 5.97,9.88 v5.73,9.88 | v11.27,1.14 11.75,1.61 11.75,2.63
  Route2 0.152: v29.71,31.86 29.85,31.72 v29.85,28.8 28.36,27.31 v28.36,22.57 | v5.73,9.88 5.73,13.55 5.29,14 5.29,14.41 5.29,14.42 v5.29,23.75
  Route15 0.152: v22.61,17.51 22.61,21.02 24,22.41 24,23.22 24.29,23.51 24.56,23.51 v29.85,28.8 29.06,28.01 24.39,28.01 24.06,28.34 v21.7,28.34 15.91,22.56 15.49,22.56 14.67,21.75 v12.25,21.75 10.24,23.75 v5.29,23.75 | v18.77,20.34 19.78,20.34 v22.61,17.51 | v18.55,17.07 18.75,17.26 18.75,17.72 19.04,18.01 19.46,18.01 19.96,17.51 v22.61,17.51 | v22.61,17.51 24.58,17.51 25.07,17.02 26.41,17.02 v34.28,9.16 | v5.73,9.88 10,5.61 10,3.4 11.27,2.13 v11.27,1.14
  Bottom 0.152: PAD9.1 28.19,35.2 28.19,35.35 28.29,35.46 29.71,35.46 29.81,35.35 29.81,32.67 29.71,32.57 v29.71,31.86 | v21.7,28.34 17.34,28.34 16.81,27.81 15.61,27.81 14.44,28.97 14.44,29.39 15,29.94 PAD26.1 15.07,34.08 15.07,35.6 14.93,35.73 12.57,35.73 12.19,35.35 12.19,35.2 PAD25.1 | v34.28,9.16 30.6,5.48 30.6,3.75 30.08,3.23 30.08,0.73 29.83,0.48 27.45,0.48 27,0.94 PAD16.1 | PAD27.1 17.13,1.14 v11.27,1.14
  pour Top: -2,37.51 -2,-2.49 37,-2.49 37,37.51
  pour Bottom: -2.5,37.51 -2.5,-1.49 39,-1.49 39,37.51
GYRO_1_CS_PIN
  Top 0.152: IC2.5 23.93,19.39 22.68,19.39 21.65,18.36 21.65,13.54 21.55,13.43 19.95,13.43 19.88,13.51 16.25,13.51 15.75,13.01 IC4.10
GYRO_1_EXTI_PIN
  Top 0.152: IC4.11 16.25,12.76 16.67,13.18 21.65,13.18 23.93,15.45 23.93,18.49 IC2.6
LED0
  Top 0.152: R9.1 8.1,19.26 8.1,15.21 8.55,14.76 IC4.62
LED1
  Top 0.152: R10.1 7.35,18.71 6.67,19.39 6.67,20.63 6.78,20.74 7.53,20.74 8.05,21.26 IC4.49
LED_STRIP  (via drill 0.35)
  Top 0.152: v10.7,20.71 9.3,20.71 IC4.50
  Route2 0.152: v23.5,4.11 10.7,16.91 v10.7,20.71
  Bottom 0.152: PAD8.1 22.5,3.11 v23.5,4.11
M1  (via drill 0.35)
  Top 0.152: X1.3 11.5,4.94 v11.5,3.51 | v17,21.01 16.75,21.26 IC4.37
  Route15 0.152: v11.5,3.51 11.5,3.01 13,1.51 16,1.51 17,2.51 v17,21.01
M2  (via drill 0.35)
  Top 0.152: X1.4 12.44,3.57 v12.5,3.51 | v16.25,20.26 IC4.38
  Route15 0.152: v12.5,3.51 12.5,2.51 13,2.01 16,2.01 16.75,2.76 16.75,19.76 v16.25,20.26
M3  (via drill 0.35)
  Top 0.152: X1.5 13.5,4.94 v13.5,3.51 | IC4.39 15.75,20.47 15.75,19.51 v16.25,19.01
  Route15 0.152: v13.5,3.51 13.5,2.76 13.75,2.51 15.75,2.51 16.25,3.01 v16.25,19.01
M4  (via drill 0.35)
  Top 0.152: X1.6 14.5,4.94 v14.5,3.51 | v15.25,21.26 IC4.40
  Route15 0.152: v14.5,3.51 15.25,4.26 v15.25,21.26
MAX7456_SPI_CS_PIN  (via drill 0.35)
  Top 0.152: IC3.8 20.42,32.7 20.42,32.14 22.55,30.01 22.55,29.3 22.75,29.1 23.66,29.1 24.25,28.51 v24.6,28.51 | IC4.28 19.55,19.26 v19.4,19.41
  Route2 0.152: v24.6,28.51 19.4,23.31 v19.4,19.41
N$1
  Top 0.305: R1.2 29.35,11.9 29.69,11.56 30.8,11.56 31.23,11.14 34.76,11.14 34.9,10.99 34.9,7.03 34.76,6.88 33.95,6.88 33.8,7.03 33.8,7.36 IC1.5
N$2
  Top 0.305: L1.1 27.36,9.6 D2.1 28.1,7.21 C8.1 32.78,9.31 33,9.53 33,9.86 IC1.2
N$3
  Top 0.305: C7.1 27.45,5.86 27.1,5.51 R3.2 24.95,6.71 24.37,6.71 22.72,8.36 R2.1
N$4
  Top 0.305: R4.2 27.05,2.91 R3.1 29.15,2.86 29.52,3.23 29.52,4.35 30.6,5.43 C7.2 30.6,6.51 31.85,7.76 IC1.4
N$5
  Top 0.152: C10.1 24.18,23.59 25.12,23.59 25.75,22.96 IC2.16 26,23.11 26.3,23.41 29.45,23.41 29.93,23.89 31.07,23.89 31.18,23.78 31.18,22.54 30.5,21.86 C9.1
N$6
  Top 0.305: C8.2 31.3,8.71 33.8,8.71 34.35,8.16 IC1.6
N$7
  Top 0.152: IC2.14 27.2,23.16 C11.2
N$8
  Top 0.152: C14.1 24.84,25.01 24.09,25.76 23.53,25.76 23.02,26.26 23.02,26.82 IC3.25
N$9  (via drill 0.35)
  Top 0.152: C13.1 v13.8,29.91 | v22.1,25.11 22.2,25.01 23,25.01 C14.2 23.55,25.01 24.23,24.33 25.47,24.33 25.58,24.44 25.58,25.58 25.15,26.01 23.93,26.01 23.43,26.51 IC3.26
  Route2 0.152: v22.1,25.11 22.1,25.3 25.1,28.3 25.1,28.72 21.51,32.31 18.69,32.31 16.29,29.91 v13.8,29.91
N$10
  Top 0.152: R5.1 13.8,34.16 C13.2
N$11
  Top 0.152: Y1.3 25.48,34.33 21.82,34.33 21.48,33.98 IC3.6
N$12
  Top 0.152: IC3.22 21.07,27.32 21.07,28.59 21.23,28.59 21.49,28.84 23.56,28.84 24.39,28.01 25.4,28.01 C15.1
N$13
  Top 0.152: Y1.1 26.98,32.23 26.03,32.23 25.92,32.34 25.92,33.29 25.2,34.01 22.3,34.01 22.12,33.83 IC3.5
N$14
  Top 0.152: LED1.1 4.06,20.01 R9.2
N$15
  Top 0.152: LED2.1 5.4,18.01 R10.2
N$16  (1 unrouted)
NRST  (via drill 0.35)
  Top 0.152: C24.1 7.3,14.16 v8.04,13.42 | v12.44,13.13 12.63,12.93 13.88,12.93 14.25,12.57 IC4.7
  Route2 0.152: v8.04,13.42 12.15,13.42 v12.44,13.13
OSC_IN
  Top 0.152: Y2.3 9.05,7.56 10.52,9.03 10.52,9.83 10.63,9.94 12.05,9.94 13.08,10.96 13.08,11.59 IC4.5
OSC_OUT
  Top 0.152: Y2.1 11.82,9.68 12.3,9.68 13.75,11.14 IC4.6
OTG_FS_DM
  Top 0.152: IC4.44 13.25,15.86 6.72,9.33 3.18,9.33 3,9.52 3,11.41 3.68,11.41 J2.2
OTG_FS_DP
  Top 0.152: J2.3 4.21,11.28 4.59,11.28 4.68,11.28 6.08,11.28 6.43,11.64 8.25,11.64 12.75,16.14 IC4.45
RX3  (via drill 0.35)
  Top 0.152: IC4.52 9.42,19.93 10.99,19.93 11.67,20.61 v11.9,20.61
  Route2 0.152: v11.9,20.61 11.54,20.97 11.54,21.75 9.1,24.19 v9.1,31.61
  Bottom 0.152: PAD6.1 9.1,34.03 v9.1,31.61
RX5  (via drill 0.35)
  Top 0.152: IC4.54 10.95,18.76 v11.3,18.41
  Route15 0.152: v25.5,26.91 20.9,22.31 15.59,22.31 11.69,18.41 v11.3,18.41
  Bottom 0.152: PAD4.1 24.19,32.82 24.19,32.41 25.5,31.1 v25.5,26.91
SPI1_MISO_PIN  (via drill 0.35)
  Top 0.152: IC2.4 v24.5,21.26 | v19.25,16.51 19.5,16.26 IC4.22
  Route2 0.152: v24.5,21.26 24,21.26 v19.25,16.51
SPI1_MOSI_PIN  (via drill 0.35)
  Top 0.152: IC2.3 25,21.76 v24.5,22.26 | v19.25,17.51 20,16.76 IC4.23
  Route2 0.152: v24.5,22.26 24,22.26 v19.25,17.51
SPI1_SCK_PIN  (via drill 0.35)
  Top 0.152: IC2.2 v26.25,22.26 | v19.25,15.51 19.5,15.76 IC4.21
  Route2 0.152: v26.25,22.26 19.5,15.51 v19.25,15.51
SPI2_MISO_PIN
  Top 0.152: IC4.35 17.75,24.31 17.62,24.44 17.62,25.33 16.8,26.16 15.98,26.16 15.87,26.26 15.87,30.11 17.33,31.56 17.4,31.56 18.23,32.39 IC3.11
SPI2_MOSI_PIN  (via drill 0.35)
  Top 0.152: IC3.9 19.52,31.23 v19.95,30.81 | v17.4,21.81 17.25,21.96 IC4.36
  Route2 0.152: v19.95,30.81 17.41,28.26 v17.41,21.82 v17.4,21.81
SPI2_SCK_PIN  (via drill 0.35)
  Top 0.152: IC3.10 18.88,31.64 v18.93,31.59 | v18.72,21.54 18.25,22.01 IC4.34
  Route2 0.152: 18.92,31.58 v18.93,31.59 19.21,31.31 20.16,31.31 20.45,31.01 20.45,30.6 18.93,29.07 18.93,21.74 v18.72,21.54
TX1  (via drill 0.35)
  Top 0.152: v14.9,24.91 14.25,24.26 IC4.42
  Route2 0.152: v16.8,29.51 14.9,27.61 v14.9,24.91
  Bottom 0.152: v16.8,29.51 18.4,31.11 18.4,32.02 18.69,32.31 19.45,32.31 21,33.86 PAD11.1
TX3  (via drill 0.35)
  Top 0.152: v11.03,21.54 11.03,21.08 11.2,20.92 11.2,20.5 10.91,20.21 10.49,20.21 10.44,20.26 IC4.51
  Route2 0.152: v11.03,21.54 7,25.58 v7,31.61
  Bottom 0.152: PAD7.1 v7,31.61
TX5  (via drill 0.35)
  Top 0.152: v11.3,19.31 11.25,19.26 IC4.53
  Route2 0.152: v25.5,31.81 22.37,31.81 21.61,32.56 15.75,32.56 13.3,30.12 13.3,21.31 v11.3,19.31
  Bottom 0.152: PAD5.1 25,32.31 v25.5,31.81
VBAT_ADC_PIN  (via drill 0.35)
  Top 0.305: R8.2 R7.1 10.7,27.46 v10.7,27.41 | v14.75,13.57 IC4.8
  Bottom 0.305: v14.75,13.57 14.75,20.94 14.67,21.02 14.67,23.44 v10.7,27.41
VCC  (via drill 0.35)
  Top 0.152: X1.2 10.44,6 11.12,6.68 12.07,6.68 12.18,6.79 12.18,7.04 C3.2
  Top 0.305: C4.2 20.7,7.41 v20.7,8.01 | v12.5,28.61 12.4,28.51 R7.2
  Top 0.508: X1.2 10.44,3.67 v10.5,3.61 | v25.27,17.53 25.31,17.53 25.8,17.03 26.8,17.03 26.83,17.06 R1.1
  Top 0.813: v31.4,10.31 32.4,10.31 IC1.3
  Bottom 0.305: PAD21.1 13,29.11 v12.5,28.61 21.2,19.91 21.2,8.01
  Bottom 0.508: v25.27,17.53 25.27,16.44 v31.4,10.31
  Bottom 0.813: v10.5,3.61 10.67,3.78 10.67,3.85 11.16,4.34 17.03,4.34 v20.7,8.01 21.2,8.01 29.1,8.01 v31.4,10.31
VTX_S  (via drill 0.35)
  Top 0.152: v16.1,31.51 16.1,31.91 15.87,32.14 15.87,34.53 R5.2
  Bottom 0.152: v16.1,31.51 17.18,32.58 17.7,32.58 17.8,32.69 17.8,32.81 PAD2.1
(copper drawn outside any net)
  shapes: Top circle x4